# Altium schematic sheet WorstCaseHT.SchDoc
size A4; SheetNumber: 10; SheetTotal: 10
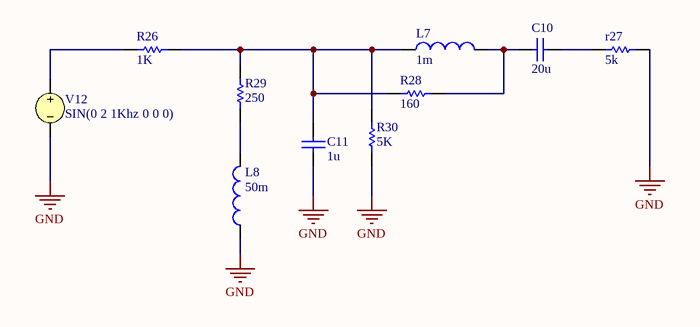
[diagram p0: WorstCaseHT.SchDoc]

## Parts
C10  value 20u  (hidden comment: Capacitor)
C11  value 1u  (hidden comment: Capacitor)
L7  value 1m  (hidden comment: Inductor)
L8  value 50m  (hidden comment: Inductor)
R26  value 1K  (hidden comment: Resistor)
r27  value 5k  (hidden comment: Resistor)
R28  value 160  (hidden comment: Resistor)
R29  value 250  (hidden comment: Resistor)
R30  value 5K  (hidden comment: Resistor)
V12  SIN(0 2 1Khz 0 0 0)

## Nets
GND: C11.1 L8.1 r27.1 R30.1 V12.2
NetC10_1: C10.1 r27.2
NetC10_2: C10.2 L7.2 R28.1
NetC11_2: C11.2 L7.1 R26.2 R28.2 R29.2 R30.2
NetL8_2: L8.2 R29.1
NetR26_1: R26.1 V12.1

## Library data of the parts
C10 C11 = Capacitor: SimulationGenericComponent: True
L7 L8 = Inductor: SimulationGenericComponent: True
R26 r27 R28-R30 = Resistor: TC1: 0; SimulationGenericComponent: True; TC2: 0
V12 = VSRC: Voltage Source; Note: PCB Footprint - Not required; AC Magnitude: 1; AC Phase: 0; DC Magnitude: 5; Amplitude: 2; Published: 8-Jun-2000; LatestRevisionDate: 17-Jul-2002; LatestRevisionNote: Re-released for DXP Platform.; PackageReference: Not Applicable; Publisher: Altium Limited; Offset: 0; Frequency: 1Khz; Delay: 0; Damping Factor: 0; Phase: 0